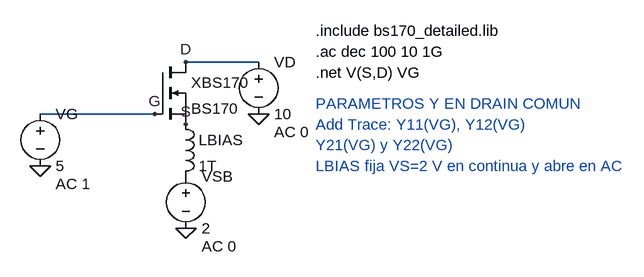
[diagram p0: schematic Simulacion.asc]
Simulacion.asc, the LTspice schematic file:
Version 4.1
SHEET 1 880 680
WIRE 512 96 400 96
WIRE 176 176 352 176
FLAG 400 96 D
FLAG 352 176 G
FLAG 400 192 S
FLAG 176 256 0
FLAG 400 352 0
FLAG 512 176 0
SYMBOL nmos 352 96 R0
SYMATTR InstName XBS170
SYMATTR Value BS170
SYMATTR Prefix X
SYMBOL voltage 176 160 R0
WINDOW 123 24 124 Left 2
WINDOW 39 0 0 Left 0
SYMATTR InstName VG
SYMATTR Value 5
SYMATTR Value2 AC 1
SYMBOL ind 384 176 R0
SYMATTR InstName LBIAS
SYMATTR Value 1T
SYMATTR SpiceLine Rser=1m
SYMBOL voltage 400 256 R0
WINDOW 123 24 124 Left 2
WINDOW 39 0 0 Left 0
SYMATTR InstName VSB
SYMATTR Value 2
SYMATTR Value2 AC 0
SYMBOL voltage 512 80 R0
WINDOW 123 24 124 Left 2
WINDOW 39 0 0 Left 0
SYMATTR InstName VD
SYMATTR Value 10
SYMATTR Value2 AC 0
TEXT 600 48 Left 2 !.include bs170_detailed.lib
TEXT 600 80 Left 2 !.ac dec 100 10 1G
TEXT 600 112 Left 2 !.net V(S,D) VG
TEXT 600 160 Left 2 ;PARAMETROS Y EN DRAIN COMUN
TEXT 600 192 Left 2 ;Add Trace: Y11(VG), Y12(VG)
TEXT 600 224 Left 2 ;Y21(VG) y Y22(VG)
TEXT 600 256 Left 2 ;LBIAS fija VS=2 V en continua y abre en AC

The netlist it stands for:
* Simulacion.asc
X§XBS170 D G S BS170  ; pins D G S
VG G 0 5 AC 1
LBIAS S P001 1T Rser=1m
VSB P001 0 2 AC 0
VD D 0 10 AC 0
.include bs170_detailed.lib
.ac dec 100 10 1G
.net V(S,D) VG
* PARAMETROS Y EN DRAIN COMUN
* Add Trace: Y11(VG), Y12(VG)
* Y21(VG) y Y22(VG)
* LBIAS fija VS=2 V en continua y abre en AC
.backanno
.end